# EAGLE schematic controller (EAGLE 9.6.2)
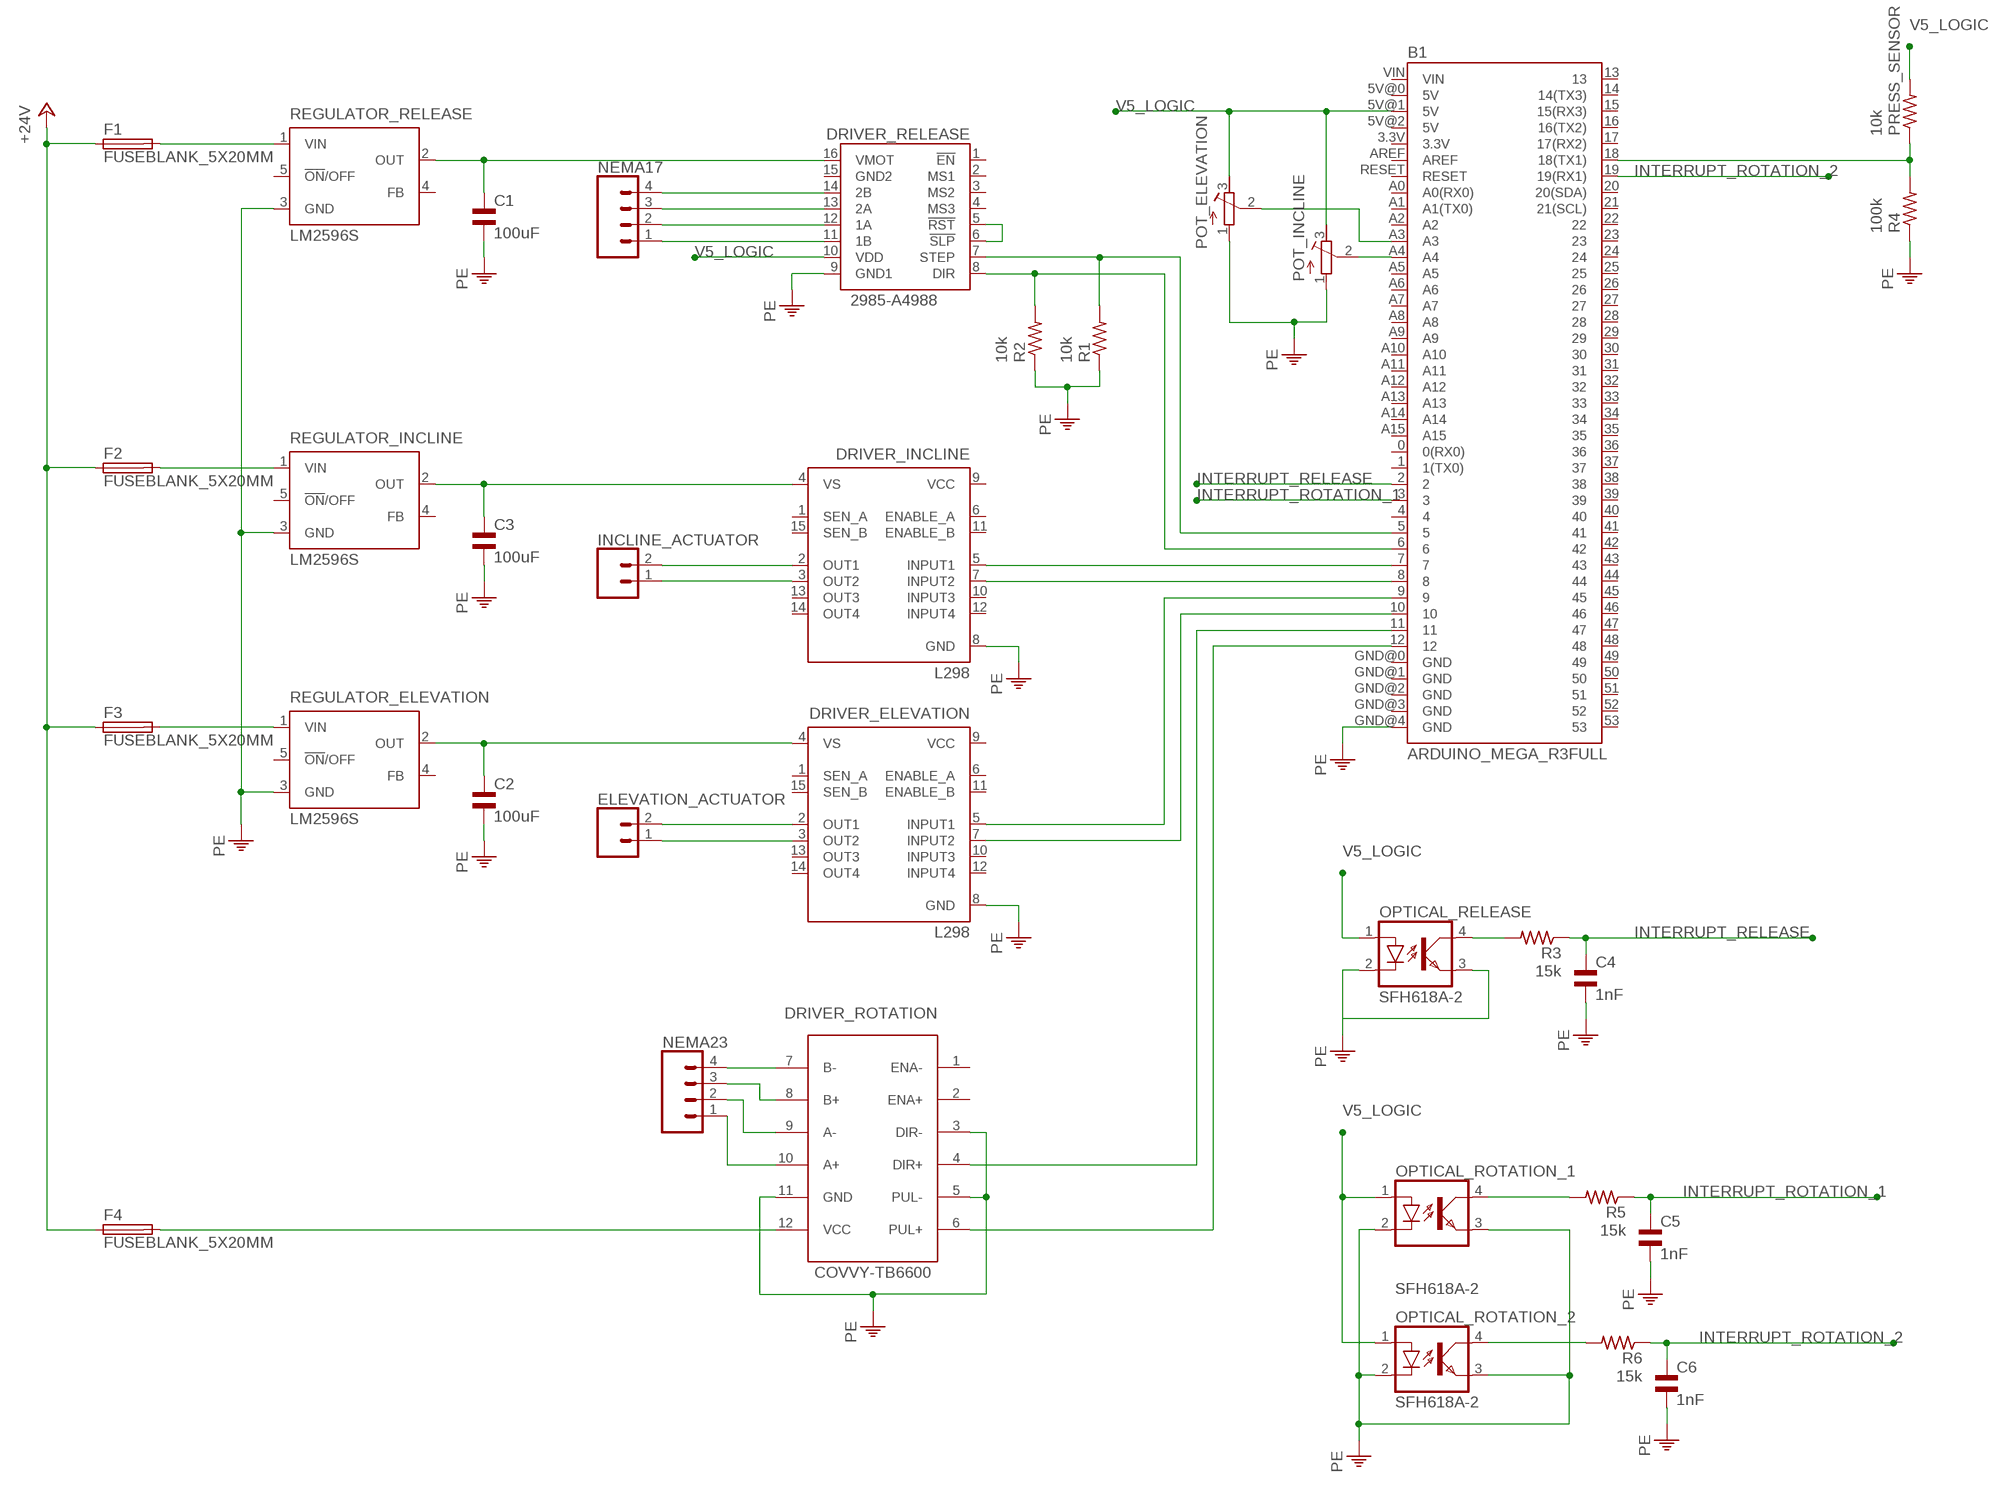
[diagram p0: schematic, sheet 1]

## Parts
B1  ARDUINO_MEGA_R3FULL  [ARDUINO_MEGA]
C1  100uF  EL-BI35-12AXIAL  [EU35-12]
C2  100uF  EL-BI35-12AXIAL  [EU35-12]
C3  100uF  EL-BI35-12AXIAL  [EU35-12]
C4  1nF  EL-BI35-12AXIAL  [EU35-12]
C5  1nF  EL-BI35-12AXIAL  [EU35-12]
C6  1nF  EL-BI35-12AXIAL  [EU35-12]
DRIVER_ELEVATION  L298  [MULTIWATT-15]
DRIVER_INCLINE  L298  [MULTIWATT-15]
DRIVER_RELEASE  2985-A4988  [A4988]
DRIVER_ROTATION  COVVY-TB6600  [COVVY_TB6600]
ELEVATION_ACTUATOR  CONN_02  [1X02]
F1  FUSEBLANK_5X20MM  [FUSE_HOLDER_5X20MM]
F2  FUSEBLANK_5X20MM  [FUSE_HOLDER_5X20MM]
F3  FUSEBLANK_5X20MM  [FUSE_HOLDER_5X20MM]
F4  FUSEBLANK_5X20MM  [FUSE_HOLDER_5X20MM]
INCLINE_ACTUATOR  CONN_02  [1X02]
NEMA17  CONN_04  [1X04]
NEMA23  CONN_04  [1X04]
OPTICAL_RELEASE  SFH618A-2  [DIP4]
OPTICAL_ROTATION_1  SFH618A-2  [DIP4]
OPTICAL_ROTATION_2  SFH618A-2  [DIP4]
POT_ELEVATION  R-TRIMM64X  [RTRIM64X]
POT_INCLINE  R-TRIMM64X  [RTRIM64X]
PRESS_SENSOR  10k  R-US_R0805  [R0805]
R1  10k  R-US_R0805  [R0805]
R2  10k  R-US_R0805  [R0805]
R3  15k  R-US_R0805  [R0805]
R4  100k  R-US_R0805  [R0805]
R5  15k  R-US_R0805  [R0805]
R6  15k  R-US_R0805  [R0805]
REGULATOR_ELEVATION  LM2596S  [TO263-5]
REGULATOR_INCLINE  LM2596S  [TO263-5]
REGULATOR_RELEASE  LM2596S  [TO263-5]

## Nets
+24V: F1.1 F2.1 F3.1 F4.1
INTERRUPT_RELEASE: B1.2 C4.1 R3.1
INTERRUPT_ROTATION_1: B1.3 C5.1 R5.1
INTERRUPT_ROTATION_2: B1.19(19(RX1)) C6.1 R6.1
N$1: B1.18(18(TX1)) PRESS_SENSOR.1 R4.2
N$2: R4.1 ; supply symbol labelled PE
N$3: DRIVER_ROTATION.7(B-) NEMA23.4
N$4: DRIVER_ROTATION.8(B+) NEMA23.3
N$5: DRIVER_ROTATION.9(A-) NEMA23.2
N$6: DRIVER_ROTATION.10(A+) NEMA23.1
N$7: F2.2 REGULATOR_INCLINE.1(VIN)
N$8: B1.A3 POT_ELEVATION.2(S)
N$9: B1.A4 POT_INCLINE.2(S)
N$10: DRIVER_ELEVATION.2(OUT1) ELEVATION_ACTUATOR.2
N$11: DRIVER_ELEVATION.3(OUT2) ELEVATION_ACTUATOR.1
N$12: DRIVER_INCLINE.2(OUT1) INCLINE_ACTUATOR.2
N$13: DRIVER_INCLINE.3(OUT2) INCLINE_ACTUATOR.1
N$14: C2.1 DRIVER_ELEVATION.4(VS) REGULATOR_ELEVATION.2(OUT)
N$15: C3.1 DRIVER_INCLINE.4(VS) REGULATOR_INCLINE.2(OUT)
N$16: DRIVER_RELEASE.14(2B) NEMA17.4
N$17: DRIVER_RELEASE.13(2A) NEMA17.3
N$18: DRIVER_RELEASE.12(1A) NEMA17.2
N$19: DRIVER_RELEASE.11(1B) NEMA17.1
N$20: DRIVER_RELEASE.5(!RST) DRIVER_RELEASE.6(!SLP)
N$21: B1.10 DRIVER_ELEVATION.7(INPUT2)
N$22: B1.9 DRIVER_ELEVATION.5(INPUT1)
N$23: B1.8 DRIVER_INCLINE.7(INPUT2)
N$24: B1.7 DRIVER_INCLINE.5(INPUT1)
N$25: B1.6 DRIVER_RELEASE.8(DIR) R2.2
N$26: B1.5 DRIVER_RELEASE.7(STEP) R1.2
N$27: OPTICAL_RELEASE.4(COL) R3.2
N$28: F1.2 REGULATOR_RELEASE.1(VIN)
N$29: DRIVER_ROTATION.12(VCC) F4.2
N$30: F3.2 REGULATOR_ELEVATION.1(VIN)
N$31: OPTICAL_ROTATION_1.4(COL) R5.2
N$32: OPTICAL_ROTATION_2.4(COL) R6.2
N$34: B1.11 DRIVER_ROTATION.4(DIR+)
N$35: B1.12 DRIVER_ROTATION.6(PUL+)
PE: B1.GND@4(GND) C1.2 C2.2 C3.2 C4.2 C5.2 C6.2 DRIVER_ELEVATION.8(GND) DRIVER_INCLINE.8(GND) DRIVER_RELEASE.9(GND1) DRIVER_ROTATION.3(DIR-) DRIVER_ROTATION.5(PUL-) DRIVER_ROTATION.11(GND) OPTICAL_RELEASE.2(C) OPTICAL_RELEASE.3(EMIT) OPTICAL_ROTATION_1.2(C) OPTICAL_ROTATION_1.3(EMIT) OPTICAL_ROTATION_2.2(C) OPTICAL_ROTATION_2.3(EMIT) POT_ELEVATION.1(A) POT_INCLINE.1(A) R1.1 R2.1 REGULATOR_ELEVATION.3(GND) REGULATOR_INCLINE.3(GND) REGULATOR_RELEASE.3(GND)
V5_LOGIC: B1.5V@1(5V) DRIVER_RELEASE.10(VDD) OPTICAL_RELEASE.1(A) OPTICAL_ROTATION_1.1(A) OPTICAL_ROTATION_2.1(A) POT_ELEVATION.3(E) POT_INCLINE.3(E) PRESS_SENSOR.2
V12_NEMA17: C1.1 DRIVER_RELEASE.16(VMOT) REGULATOR_RELEASE.2(OUT)
Unconnected: B1.0(0(RX0)) B1.1(1(TX0)) B1.3.3V B1.4 B1.5V@0(5V) B1.5V@2(5V) B1.13 B1.14(14(TX3)) B1.15(15(RX3)) B1.16(16(TX2)) B1.17(17(RX2)) B1.20(20(SDA)) B1.21(21(SCL)) B1.22 B1.23 B1.24 B1.25 B1.26 B1.27 B1.28 B1.29 B1.30 B1.31 B1.32 B1.33 B1.34 B1.35 B1.36 B1.37 B1.38 B1.39 B1.40 B1.41 B1.42 B1.43 B1.44 B1.45 B1.46 B1.47 B1.48 B1.49 B1.50 B1.51 B1.52 B1.53 B1.A0(A0(RX0)) B1.A1(A1(TX0)) B1.A2 B1.A5 B1.A6 B1.A7 B1.A8 B1.A9 B1.A10 B1.A11 B1.A12 B1.A13 B1.A14 B1.A15 B1.AREF B1.GND@0(GND) B1.GND@1(GND) B1.GND@2(GND) B1.GND@3(GND) B1.RESET B1.VIN DRIVER_ELEVATION.1(SEN_A) DRIVER_ELEVATION.6(ENABLE_A) DRIVER_ELEVATION.10(INPUT3) DRIVER_ELEVATION.11(ENABLE_B) DRIVER_ELEVATION.12(INPUT4) DRIVER_ELEVATION.13(OUT3) DRIVER_ELEVATION.14(OUT4) DRIVER_ELEVATION.15(SEN_B) DRIVER_INCLINE.1(SEN_A) DRIVER_INCLINE.6(ENABLE_A) DRIVER_INCLINE.10(INPUT3) DRIVER_INCLINE.11(ENABLE_B) DRIVER_INCLINE.12(INPUT4) DRIVER_INCLINE.13(OUT3) DRIVER_INCLINE.14(OUT4) DRIVER_INCLINE.15(SEN_B) DRIVER_RELEASE.1(!EN) DRIVER_RELEASE.2(MS1) DRIVER_RELEASE.3(MS2) DRIVER_RELEASE.4(MS3) DRIVER_ROTATION.1(ENA-) DRIVER_ROTATION.2(ENA+) REGULATOR_ELEVATION.4(FB) REGULATOR_ELEVATION.5(!ON!/OFF) REGULATOR_INCLINE.4(FB) REGULATOR_INCLINE.5(!ON!/OFF) REGULATOR_RELEASE.4(FB) REGULATOR_RELEASE.5(!ON!/OFF)

## Power pins joined to a net without a drawn wire
GND2: DRIVER_RELEASE.15(GND2)
VCC: DRIVER_ELEVATION.9(VCC) DRIVER_INCLINE.9(VCC)

## Library data of the parts
B1 = SparkFun-Boards:ARDUINO_MEGA_R3: Arduino Mega R3 ATmega2560 R3 compatible footprint. SparkFun Products: Arduino Mega 2560 R3 <https://www.sparkfun.com/products/11061>
C1-C6 = rcl:EL-: BIPOLAR ELECTROLYTIC CAPACITOR; SPICEPREFIX: C
DRIVER_ELEVATION DRIVER_INCLINE = st-microelectronics:L298: DUAL FULL-BRIDGE DRIVER; MPN: L298N; OC_FARNELL: 1589425; OC_NEWARK: 32M1527
DRIVER_RELEASE = pololu-stepper-driver:2985-A4988: A4988 Stepper Motor Driver Carrier (Bulk; Header Pins Soldered) #2985 A4988 Stepper Motor Driver Carrier (Bulk; Header Pins Soldered) <https://www.pololu.com/product/2985> in Japan, Suzaku Lab. Ltd. <https://suzakugiken.jp/> #2985 A4988 ステッピングモータドライバボード (バルク品 ピンヘッダ実装済み) <https://szc.jp/po2985>
DRIVER_ROTATION = COVVY-TB6600:COVVY-TB6600; DRIVER_ROTATION: 1
ELEVATION_ACTUATOR INCLINE_ACTUATOR = SparkFun-Connectors:CONN_02: Multi connection point. Often used as Generic Header-pin footprint for 0.1 inch spaced/style header connections On any of the 0.1 inch spaced packages, you can populate with these: Break Away Headers - Straight <https://www.sparkfun.com/products/116> (PRT-00116) Break Away Male Headers - Right Angle <https://www.sparkfun.com/products/553> (PRT-00553) Female Headers <https://www.sparkfun.com/products/115> (PRT-00115) Break Away Headers - Machine Pin <https://www.sparkfun.com/products/117> (PRT-00117) Break Away Female Headers - Swiss Machine Pin <https://www.sparkfun.com/products/743> (PRT-00743) For SCREWTERMINALS and SPRING TERMINALS visit here: Screw Terimnals on SparkFun.com <https://www.sparkfun.com/search/results?term=Screw+Terminals> (5mm/3.5mm/2.54mm spacing) This device is also useful as a general connection point to wire up your design to another part of your project. Our various solder wires solder well into these plated through hole pads. Hook-Up Wire - Assortment (Stranded, 22 AWG) <https://www.sparkfun.com/products/11375> (PRT-11375) Hook-Up Wire - Assortment (Solid Core, 22 AWG) <https://www.sparkfun.com/products/11367> (PRT-11367) View the entire wire category on our website here <https://www.sparkfun.com/categories/141> Special notes: Molex polarized connector foot print use with: PRT-08233 with associated crimp pins and housings. 2.54_SCREWTERM for use with PRT-10571. 3.5mm Screw Terminal footprints for PRT-08084 5mm Screw Terminal footprints for use with PRT-08432
F1-F4 = fuse:FUSE: Fuse; OC_FARNELL: unknown; OC_NEWARK: unknown
NEMA17 NEMA23 = SparkFun-Connectors:CONN_04: Multi connection point. Often used as Generic Header-pin footprint for 0.1 inch spaced/style header connections On any of the 0.1 inch spaced packages, you can populate with these: Break Away Headers - Straight <https://www.sparkfun.com/products/116> (PRT-00116) Break Away Male Headers - Right Angle <https://www.sparkfun.com/products/553> (PRT-00553) Female Headers <https://www.sparkfun.com/products/115> (PRT-00115) Break Away Headers - Machine Pin <https://www.sparkfun.com/products/117> (PRT-00117) Break Away Female Headers - Swiss Machine Pin <https://www.sparkfun.com/products/743> (PRT-00743) For SCREWTERMINALS and SPRING TERMINALS visit here: Screw Terimnals on SparkFun.com <https://www.sparkfun.com/search/results?term=Screw+Terminals> (5mm/3.5mm/2.54mm spacing) This device is also useful as a general connection point to wire up your design to another part of your project. Our various solder wires solder well into these plated through hole pads. Hook-Up Wire - Assortment (Stranded, 22 AWG) <https://www.sparkfun.com/products/11375> (PRT-11375) Hook-Up Wire - Assortment (Solid Core, 22 AWG) <https://www.sparkfun.com/products/11367> (PRT-11367) View the entire wire category on our website here <https://www.sparkfun.com/categories/141> Special notes: Molex polarized connector foot print use with SKU : PRT-08231 with associated crimp pins and housings. 1MM SMD Version SKU: PRT-10208; PROD_ID: CONN-09696
OPTICAL_RELEASE OPTICAL_ROTATION_1 OPTICAL_ROTATION_2 = optocoupler:SFH618?*: Optocoupler, Phototransistor Output, Low Input Current Source: Data sheet <http://www.vishay.com/docs/83673/sfh618.pdf>; MF: VISHAY/TELEFUNKEN; MPN: SFH618A-2; OC_FARNELL: 6424855; OC_NEWARK: 21H7744
POT_ELEVATION POT_INCLINE = rcl:R-TRIMM: Trimm resistor; SPICEMODEL: X; SPICEPREFIXL: POT
PRESS_SENSOR R1-R6 = rcl:R-US_: RESISTOR, American symbol; SPICEPREFIX: R
REGULATOR_ELEVATION REGULATOR_INCLINE REGULATOR_RELEASE = national-semiconductor:LM2596: SIMPLE SWITCHER® Power Converter 150 kHz 3A Step-Down Voltage Regulator Source: http://www.national.com/ds/LM/LM2596.pdf; MF: NATIONAL SEMICONDUCTOR; MPN: LM2596S-ADJ/NOPB; OC_FARNELL: 9494367; OC_NEWARK: 41K3842